# Altium schematic sheet Dev.SchDoc
size 292 x 193 mm; Author: Power Lin; DocumentNumber: 4; SheetNumber: 4; SheetTotal: 3; Website: wiki-power.com
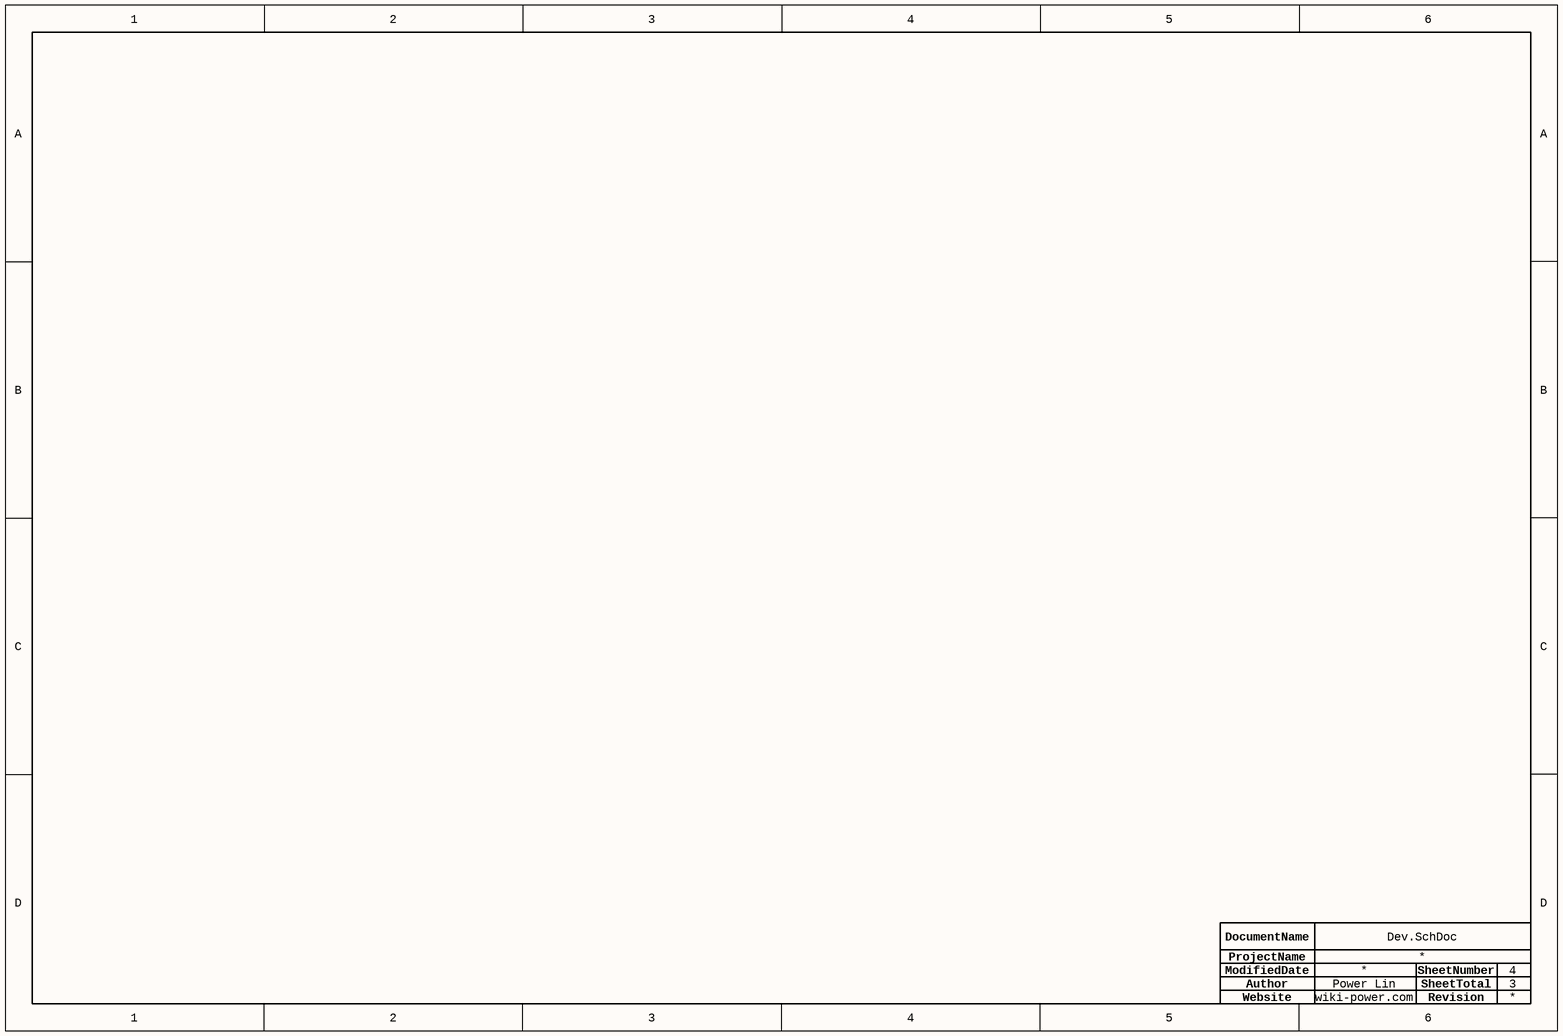
[diagram p0: Dev.SchDoc]

## Notes on the sheet
- Author
- DocumentName
- ModifiedDate
- ProjectName
- SheetNumber
- SheetTotal
- Website
- Revision